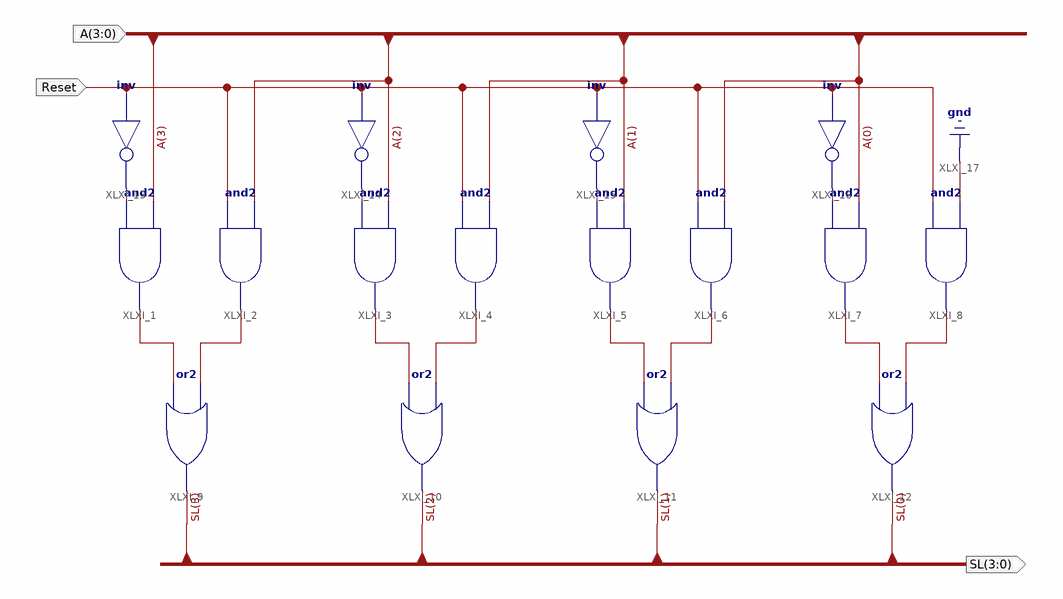
[diagram p0: schematic sheet 1]
// Xilinx ISE schematic LeftShift4Bit.sch (artix7) as structural Verilog: 16 symbols, 3 ports
module LeftShift4Bit (
  input  [3:0] A,
  input  Reset,
  output [3:0] SL
);

  wire XLXN_2, XLXN_3, XLXN_4, XLXN_5, XLXN_6, XLXN_7, XLXN_8, XLXN_9, XLXN_10, XLXN_11, XLXN_12, XLXN_13;

  and XLXI_1 (XLXN_6, XLXN_2, A[3]);
  and XLXI_2 (XLXN_7, Reset, A[2]);
  and XLXI_3 (XLXN_8, XLXN_3, A[2]);
  and XLXI_4 (XLXN_9, Reset, A[1]);
  and XLXI_5 (XLXN_10, XLXN_4, A[1]);
  and XLXI_6 (XLXN_11, Reset, A[0]);
  and XLXI_7 (XLXN_12, XLXN_5, A[0]);
  and XLXI_8 (XLXN_13, Reset, 1'b0);
  or XLXI_9 (SL[3], XLXN_6, XLXN_7);
  or XLXI_10 (SL[2], XLXN_8, XLXN_9);
  or XLXI_11 (SL[1], XLXN_10, XLXN_11);
  or XLXI_12 (SL[0], XLXN_12, XLXN_13);
  not XLXI_13 (XLXN_2, Reset);
  not XLXI_14 (XLXN_3, Reset);
  not XLXI_15 (XLXN_4, Reset);
  not XLXI_16 (XLXN_5, Reset);
endmodule
